# EAGLE design wemos-boost-rev-1b (EAGLE 7.3.0)
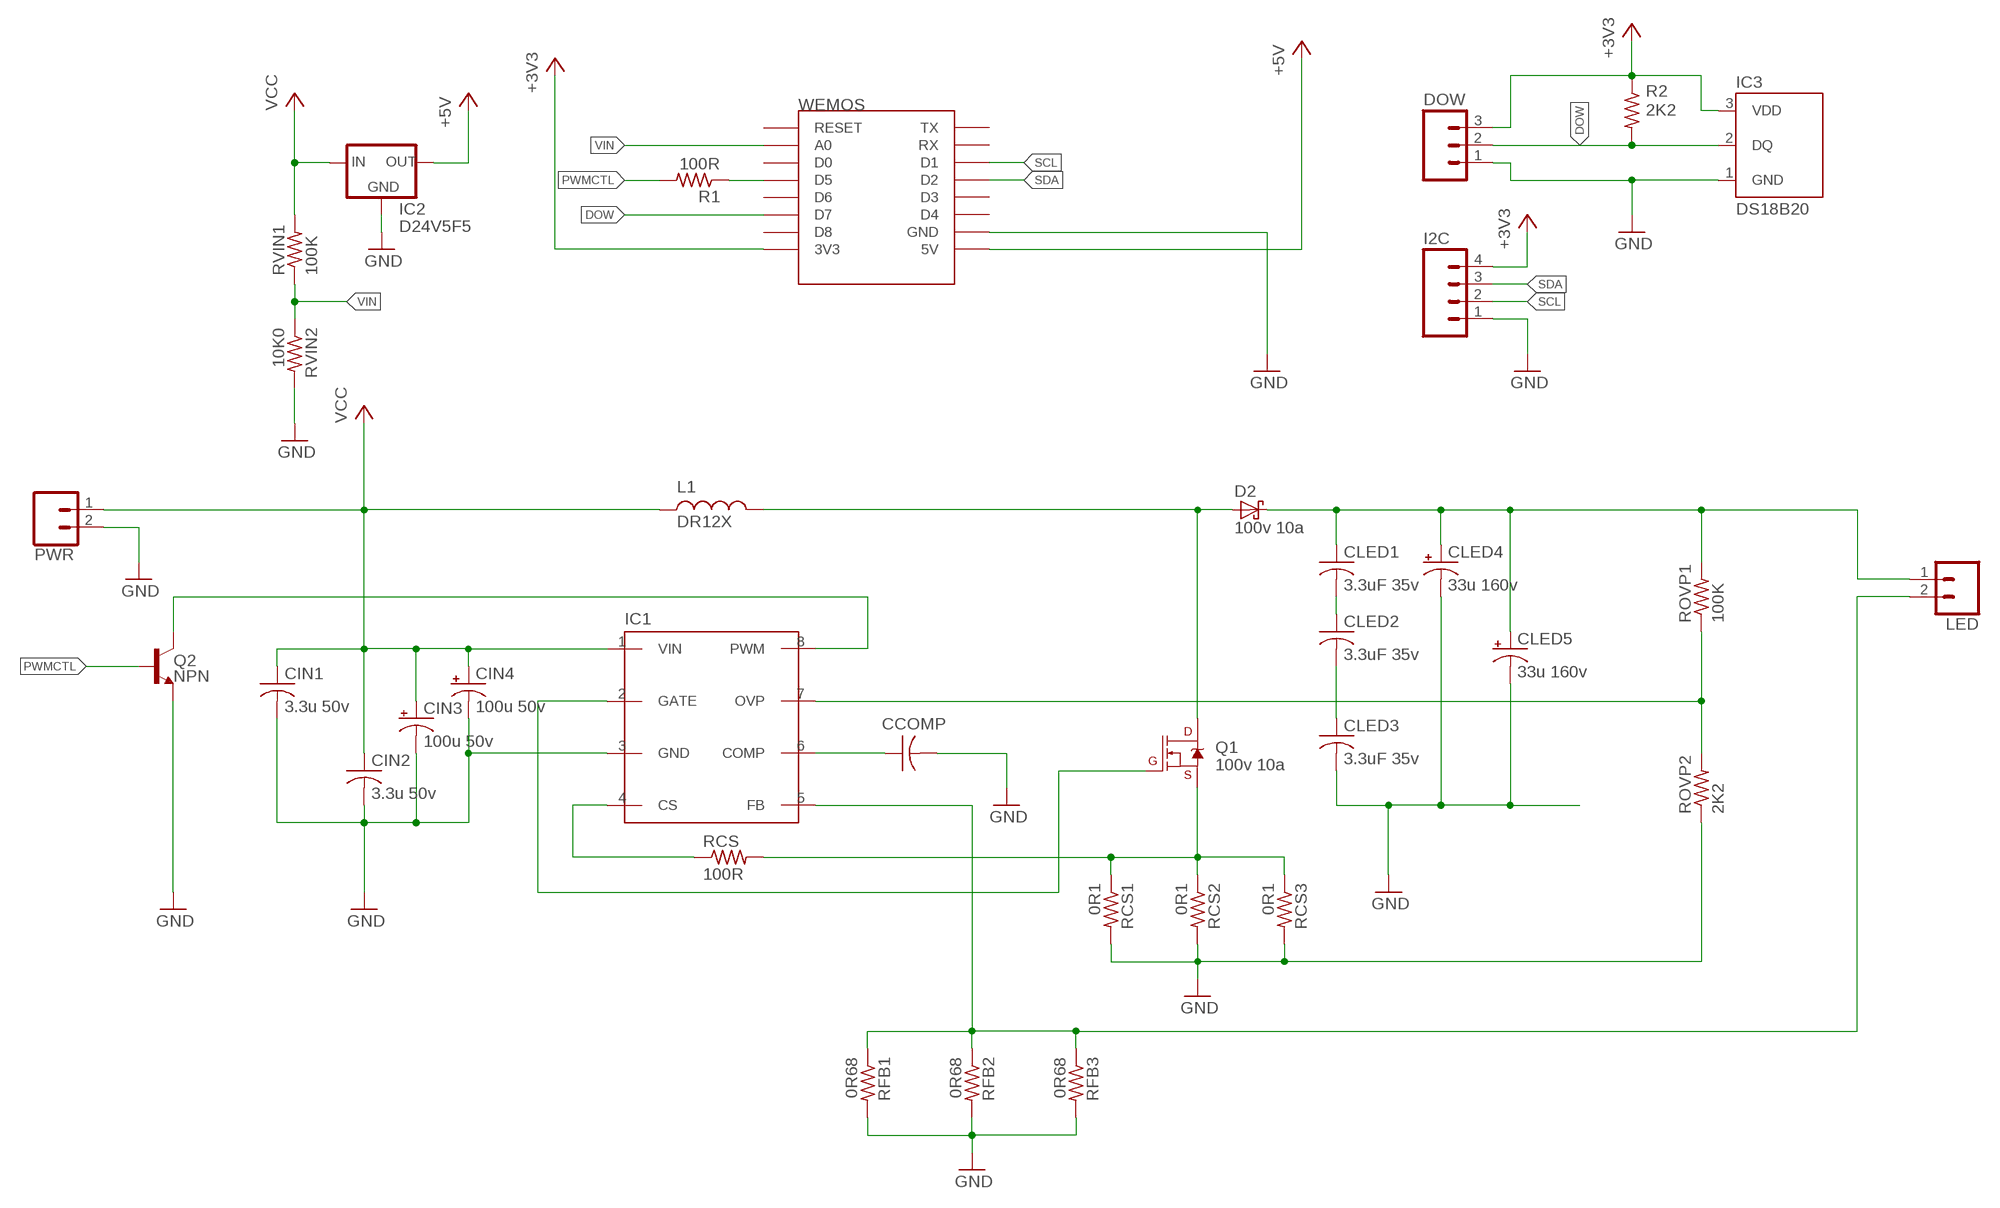
[diagram p0: schematic, sheet 1]

## Parts
CCOMP  C-USC0603  [C0603]
CIN1  3.3u 50v  C-USC1210  [C1210]
CIN2  3.3u 50v  C-USC1210  [C1210]
CIN3  100u 50v  CPOL-USF  [PANASONIC_F]
CIN4  100u 50v  CPOL-USF  [PANASONIC_F]
CLED1  3.3uF 35v  C-USC0805  [C0805]
CLED2  3.3uF 35v  C-USC0805  [C0805]
CLED3  3.3uF 35v  C-USC0805  [C0805]
CLED4  33u 160v  CPOL-USG  [PANASONIC_G]
CLED5  33u 160v  CPOL-USG  [PANASONIC_G]
D2  100v 10a  SCHOTTKY-SMB  [SMB]
DOW  M03SCREW_LOCK  [SCREWTERMINAL-3.5MM-3_LOCK.007S]
I2C  M04SCREW_LOCK  [SCREWTERMINAL-3.5MM-4_LOCK]
IC1  AL8853S-13  [SOP08]
IC2  D24V5F5  78XXS  [78XXS]
IC3  DS18B20  [TO-92-AMMO]
L1  DR12X  [DR12X]
LED  CONN_025MM  [SCREWTERMINAL-5MM-2]
PWR  CONN_025MM  [SCREWTERMINAL-5MM-2]
Q1  100v 10a  MOSFET-NCH-FDD8780  [TO-252/DPAK]
Q2  NPN  TRANS_NPN-MMBT2222AL  [SOT23-3]
R1  100R  R-US_R0603  [R0603]
R2  2K2  R-US_R0603  [R0603]
RCS  100R  R-US_R0603  [R0603]
RCS1  0R1  R-US_R2010  [R2010]
RCS2  0R1  R-US_R2010  [R2010]
RCS3  0R1  R-US_R2010  [R2010]
RFB1  0R68  R-US_R1206  [R1206]
RFB2  0R68  R-US_R1206  [R1206]
RFB3  0R68  R-US_R1206  [R1206]
ROVP1  100K  R-US_R0603  [R0603]
ROVP2  2K2  R-US_R0603  [R0603]
RVIN1  100K  R-US_R0603  [R0603]
RVIN2  10K0  R-US_R0603  [R0603]
WEMOS  WEMOS-D1-MINI  [WEMOS-D1-MINI]

## Nets
+3V3: DOW.3 I2C.4 IC3.3(VDD) R2.1 WEMOS.3V3
+5V: IC2.OUT WEMOS.5V
COMP: CCOMP.1 IC1.6(COMP)
CS: IC1.4(CS) RCS.1
CS`: Q1.3(S) RCS1.1 RCS2.1 RCS3.1 RCS.2
DOW: DOW.2 IC3.2(DQ) R2.2 WEMOS.D7
FB: IC1.5(FB) LED.2 RFB1.1 RFB2.1 RFB3.1
GATE: IC1.2(GATE) Q1.1(G)
GND: CCOMP.2 CIN1.2 CIN2.2 CIN3.- CIN4.- CLED3.2 CLED4.- CLED5.- DOW.1 I2C.1 IC1.3(GND) IC2.GND IC3.1(GND) PWR.2 Q2.2(E) RCS1.2 RCS2.2 RCS3.2 RFB1.2 RFB2.2 RFB3.2 ROVP2.1 RVIN2.2 WEMOS.GND
LEDPWR: CLED1.1 CLED4.+ CLED5.+ D2.K LED.1 ROVP1.2
N$1: R1.1 WEMOS.D5
N$2: CLED1.2 CLED2.1
N$3: CLED2.2 CLED3.1
OVP: IC1.7(OVP) ROVP1.1 ROVP2.2
PWM: IC1.8(PWM) Q2.3(C)
PWMCTL: Q2.1(B) R1.2
SCL: I2C.2 WEMOS.D1
SDA: I2C.3 WEMOS.D2
SWITCHNODE: D2.A L1.P$1 Q1.2(D)
VCC: CIN1.1 CIN2.1 CIN3.+ CIN4.+ IC1.1(VIN) IC2.IN L1.P$2 PWR.1 RVIN1.2
VIN: RVIN1.1 RVIN2.1 WEMOS.A0
Unconnected: WEMOS.D0 WEMOS.D3 WEMOS.D4 WEMOS.D6 WEMOS.D8 WEMOS.RESET WEMOS.RX WEMOS.TX

## Library data of the parts
CCOMP CIN1 CIN2 CLED1-CLED3 = rcl:C-US: CAPACITOR, American symbol
CIN3 CIN4 CLED4 CLED5 = rcl:CPOL-US: POLARIZED CAPACITOR, American symbol
D2 = diode-special-packages:SCHOTTKY
DOW = SparkFun-Connectors:M03: Header 3 Standard 3-pin 0.1" header. Use with straight break away headers (SKU : PRT-00116), right angle break away headers (PRT-00553), swiss pins (PRT-00743), machine pins (PRT-00117), and female headers (PRT-00115). Molex polarized connector foot print use with SKU : PRT-08232 with associated crimp pins and housings.; PROD_ID: CONN-08288
I2C = SparkFun-Connectors:M04: Header 4 Standard 4-pin 0.1" header. Use with straight break away headers (SKU : PRT-00116), right angle break away headers (PRT-00553), swiss pins (PRT-00743), machine pins (PRT-00117), and female headers (PRT-00115). Molex polarized connector foot print use with SKU : PRT-08231 with associated crimp pins and housings. 1MM SMD Version SKU: PRT-10208
IC1 = vreg-special:AL8853S-13: The AL8853 is a highly integrated and cost effective Light Emitting Diode (LED) controller. It provides a high performance LED backlight solution with low BOM cost.
IC2 = v-reg:78XXS: VOLTAGE REGULATOR
IC3 = SparkFun-Sensors:DS18B20: Dallas/Maxim DS18B20 1-wire temperature sensor Datasheet: http://datasheets.maximintegrated.com/en/ds/DS18B20.pdf temp thermometer 1-wire one-wire one wire; STORE_ID: SEN-00245
L1 = inductor-power:DR
LED PWR = SparkFun-Connectors:CONN_02: Multi connection point. Often used as Generic Header-pin footprint for 0.1 inch spaced/style header connections On any of the 0.1 inch spaced packages, you can populate with these: Break Away Headers - Straight <https://www.sparkfun.com/products/116> (PRT-00116) Break Away Male Headers - Right Angle <https://www.sparkfun.com/products/553> (PRT-00553) Female Headers <https://www.sparkfun.com/products/115> (PRT-00115) Break Away Headers - Machine Pin <https://www.sparkfun.com/products/117> (PRT-00117) Break Away Female Headers - Swiss Machine Pin <https://www.sparkfun.com/products/743> (PRT-00743) For SCREWTERMINALS and SPRING TERMINALS visit here: Screw Terimnals on SparkFun.com <https://www.sparkfun.com/search/results?term=Screw+Terminals> (5mm/3.5mm/2.54mm spacing) This device is also useful as a general connection point to wire up your design to another part of your project. Our various solder wires solder well into these plated through hole pads. Hook-Up Wire - Assortment (Stranded, 22 AWG) <https://www.sparkfun.com/products/11375> (PRT-11375) Hook-Up Wire - Assortment (Solid Core, 22 AWG) <https://www.sparkfun.com/products/11367> (PRT-11367) View the entire wire category on our website here <https://www.sparkfun.com/categories/141> Special notes: Molex polarized connector foot print use with: PRT-08233 with associated crimp pins and housings. 2.54_SCREWTERM for use with PRT-10571. 3.5mm Screw Terminal footprints for PRT-08084 5mm Screw Terminal footprints for use with PRT-08432; SF_SKU: PRT-08432
Q1 = SparkFun-DiscreteSemi:MOSFET-NCH: N-channel MOSFETs Voltage controlled devices that allow control of high current outputs. SparkFun Products: SparkFun OpenScale <https://www.sparkfun.com/products/13261> SparkFun Digital Sandbox <https://www.sparkfun.com/products/12651> SparkFun Monster Moto Shield <https://www.sparkfun.com/products/10182> SparkFun MOSFET Power Controller <https://www.sparkfun.com/products/11214>; PROD_ID: TRANS-09984; VALUE: 35A/25V/8.5mΩ
Q2 = SparkFun-DiscreteSemi:TRANS_NPN: NPN transistor Current controlled devices typically used to amplify current or used as a switch. BC547 - COM-08928 <http://www.sparkfun.com/products/8928> (TO-92 45V 100mA) (1.Collector 2.Base 3.Emitter) 2N3904 - COM-00521 <http://www.sparkfun.com/products/521> (TO-92 40V 200mA) (1.Emitter 2.Base 3.Collector) P2N2222A - COM-12852 <http://www.sparkfun.com/products/12852> (TO-92 40V 600mA) (1.Collector 2.Base 3.Emitter); PROD_ID: TRANS-08049; VALUE: 600mA/40V
R1 R2 RCS RCS1-RCS3 RFB1-RFB3 ROVP1 ROVP2 RVIN1 RVIN2 = rcl:R-US_: RESISTOR, American symbol
WEMOS = esp8266modules:WEMOS-D1-MINI: WeMos.cc D1 mini ESP8266 module

## Board
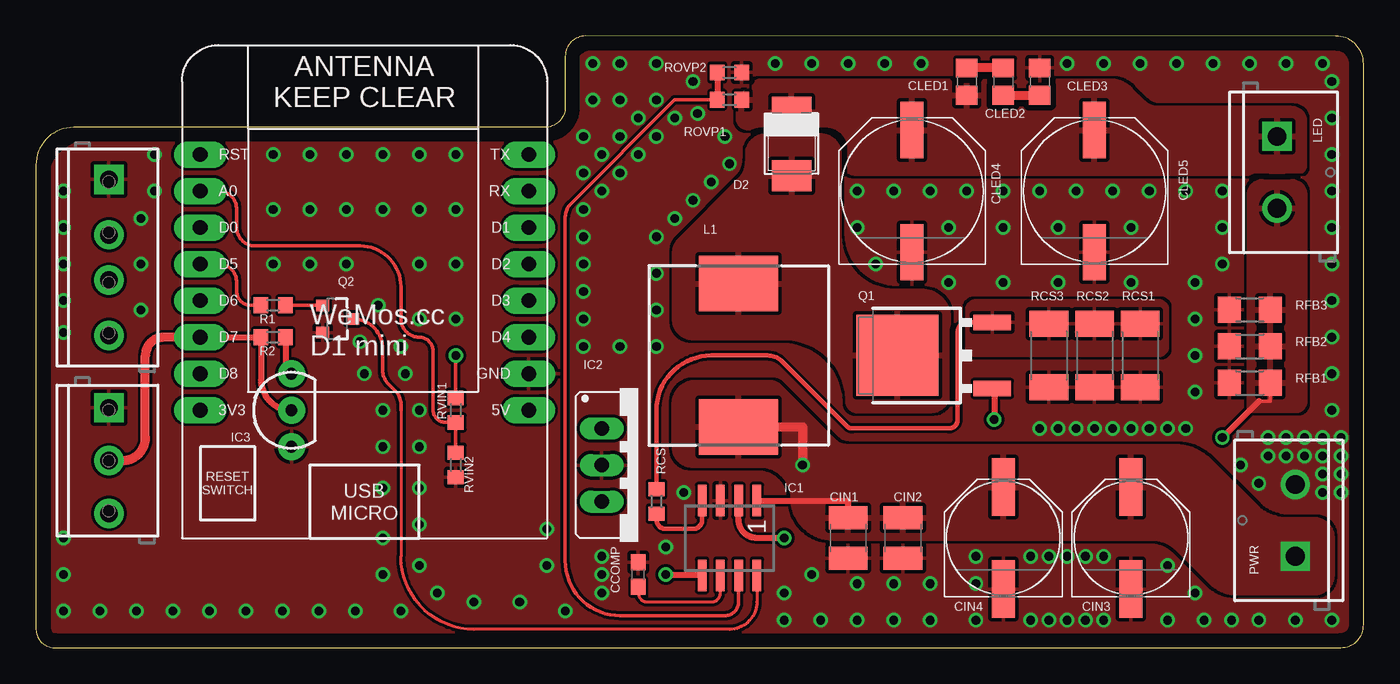
[diagram p1: board, top side]
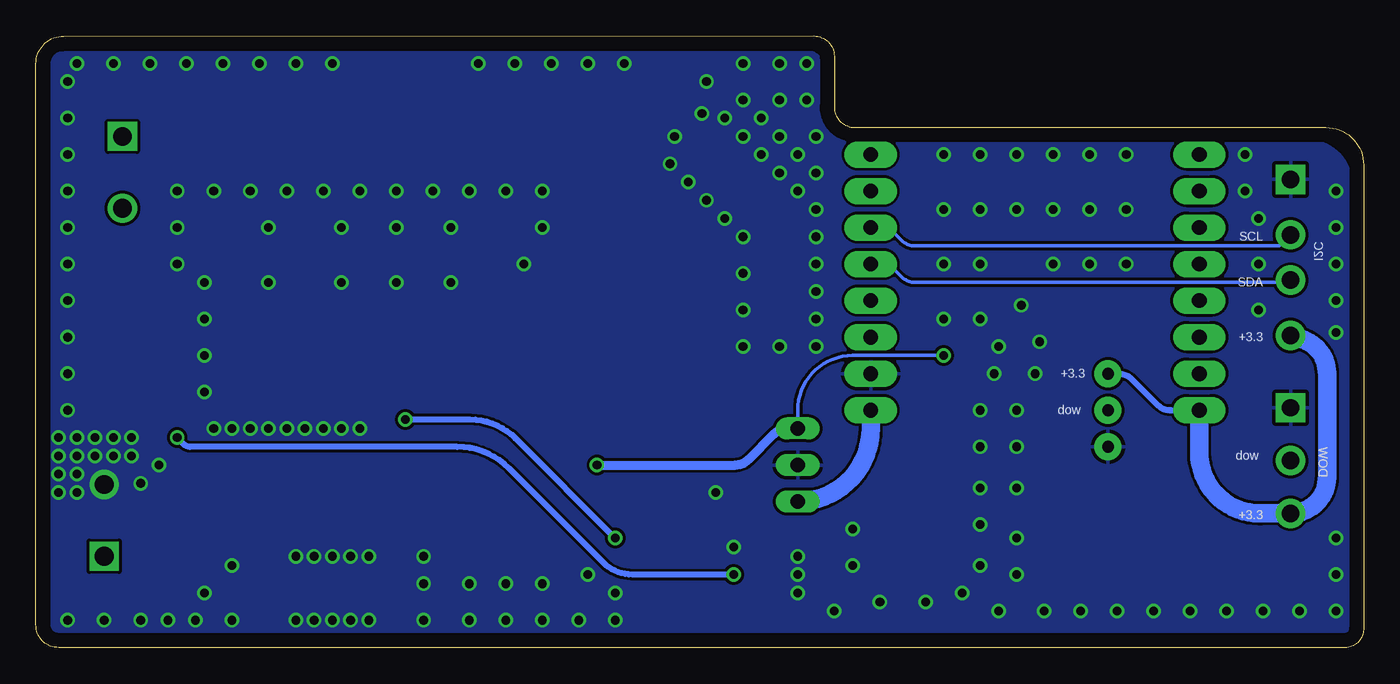
[diagram p2: board, bottom side, seen from below]

Size 92.38 x 42.54 mm. Coordinates in mm from the lower left corner, seen from the top.
Outline: 1.27,0 90.8,0 arc90 92.38,1.58 92.38,40.61 arc90 90.46,42.53 38.25,42.55 arc90 36.83,41.12 36.83,37.6 arc-90 35.41,36.19 2.62,36.19 arc90 0,33.56 0,1.27 arc90 1.27,0
Copper layers (1*16): Top 0.035mm / dielectric 1.5mm / Bottom 0.035mm
Design rules "default": minimum track width 10mil, minimum drill 24mil, track to track 8mil, track to pad 8mil, pad to pad 8mil, via to via 8mil, smd to smd 8mil, copper to edge 40mil, drill to drill 8mil, minimum pad ring 10mil, minimum via ring 8mil, stop-mask expansion 4mil, vias tented up to drill 0mil, thermal gap 10mil

### Footprints (pad centres in the part's own frame; a part is rotated, then mirrored left to right if it is on the bottom)
C0603 = smd 1.1 x 1: 1 -0.85,0; 2 0.85,0
C1210 = smd 1.6 x 2.7: 1 -1.4,0; 2 1.4,0
PANASONIC_F = smd 4 x 1.6: + 3.55,0; - -3.55,0
C0805 = smd 1.3 x 1.5: 1 -0.95,0; 2 0.95,0
PANASONIC_G = smd 3.9 x 1.6: + 4.25,0; - -4.25,0
SMB = smd 2.159 x 2.743: A 2.108,-0.102; K -2.311,-0.127
SCREWTERMINAL-3.5MM-3_LOCK.007S = drill 1.2 pad 2.032 square: 1 -0.178,0 | drill 1.2 pad 2.032: 2 3.5,0; 3 7.178,0
SCREWTERMINAL-3.5MM-4_LOCK = drill 1.2 pad 2.032 square: 1 -0.178,0 | drill 1.2 pad 2.032: 2 3.678,0; 3 6.822,0; 4 10.678,0
SOP08 = smd 0.6 x 2.2: 1 -1.905,-2.6; 2 -0.635,-2.6; 3 0.635,-2.6; 4 1.905,-2.6; 5 1.905,2.6; 6 0.635,2.6; 7 -0.635,2.6; 8 -1.905,2.6
78XXS = drill 1.016 long: GND 0,-2.54; IN -2.54,-2.54; OUT 2.54,-2.54
TO-92-AMMO = drill 0.813 pad 1.88: 1 -2.54,0; 2 0,0; 3 2.54,0
DR12X = smd 3.85 x 5.5: P$1 -5,0; P$2 4.975,0
SCREWTERMINAL-5MM-2 = drill 1.3 pad 2.032 square: 1 0,0 | drill 1.3 pad 2.032: 2 5,0
TO-252/DPAK = smd 1.06 x 2.6: 1 -2.3,-4.31; 3 2.3,-4.31 | smd 5.632 x 5.7: 2 0,2.288
SOT23-3 = smd 0.8 x 0.9: 1 -0.95,-1; 2 0.95,-1; 3 0,1.1
R0603 = smd 1 x 1.1: 1 -0.85,0; 2 0.85,0
R2010 = smd 1.8 x 2.7: 1 -2.2,0; 2 2.2,0
R1206 = smd 1.6 x 1.803: 1 -1.422,0; 2 1.422,0
WEMOS-D1-MINI = drill 1.016 pad 1.829 long: 3V3 -10.16,-10.16; 5V 12.7,-10.16; A0 -10.16,5.08; D0 -10.16,2.54; D1 12.7,2.54; D2 12.7,0; D3 12.7,-2.54; D4 12.7,-5.08; D5 -10.16,0; D6 -10.16,-2.54; D7 -10.16,-5.08; D8 -10.16,-7.62; GND 12.7,-7.62; RESET -10.16,7.62; RX 12.7,5.08; TX 12.7,7.62

### Placement (x,y rotation side)
CCOMP  41.91,5.08 90 top
CIN1  56.52,7.62 270 top
CIN2  60.33,7.62 270 top
CIN3  76.2,7.62 90 top
CIN4  67.31,7.62 90 top
CLED1  64.77,39.37 90 top
CLED2  67.31,39.37 270 top
CLED3  69.85,39.37 90 top
CLED4  60.96,31.75 90 top
CLED5  73.66,31.75 90 top
D2  52.7,34.92 270 top
DOW  5.08,16.51 270 top
I2C  5.08,32.38 270 top
IC1  48.26,7.62 180 top
IC2  41.91,12.7 270 top
IC3  17.78,16.51 90 top
L1  48.9,20.32 270 top
LED  86.36,35.56 270 top
PWR  87.63,6.35 90 top
Q1  62.23,20.32 90 top
Q2  20.95,22.86 270 top
R1  16.51,23.81 0 top
R2  16.51,21.59 180 top
RCS  43.18,10.16 90 top
RCS1  76.83,20.32 270 top
RCS2  73.66,20.32 270 top
RCS3  70.48,20.32 270 top
RFB1  84.45,18.41 180 top
RFB2  84.45,20.95 180 top
RFB3  84.45,23.5 180 top
ROVP1  48.26,38.1 0 top
ROVP2  48.26,40.01 180 top
RVIN1  29.21,16.51 90 top
RVIN2  29.21,12.7 270 top
WEMOS  21.59,26.67 0 top

### Tracks (layer width: path | path; a pad name or v marks a point on that pad's centre or on a via)
+3V3
  Top 0.406: R2.1 17.36,19.05 IC3.3
  Bottom 0.406: IC3.3 17.04,19.05 arc45 16.14,18.68 14.34,16.88 arc-45 13.44,16.51 WEMOS.3V3
  Bottom 1.27: I2C.4 5.08,21.59 arc90 2.54,19.05 2.54,11.87 arc90 DOW.3 7.21,9.33 arc90 11.43,13.55 WEMOS.3V3
+5V
  Bottom 1.27: IC2.OUT arc-90 34.29,15.24 WEMOS.5V
COMP
  Top 0.203: CCOMP.1 41.91,3.81 arc90 42.55,3.17 46.99,3.17 arc90 47.62,3.81 IC1.6
CS
  Top 0.203: RCS.1 43.18,8.89
  Top 0.305: 43.18,8.89 arc90 43.81,8.26 45.72,8.26 arc90 46.35,8.89 IC1.4
CS`
  Top 0.305: RCS.2 43.18,16.51 arc-90 46.99,20.32 50.91,20.32 arc-45 51.93,19.89 56.42,15.4 arc45 56.82,15.24 63.5,15.24 arc90 64.14,15.88 64.14,21.94 arc-90 64.81,22.62 Q1.3
  pour Top (isolate 0.406, rank 4): 78.74,23.5 78.74,20.95 arc-90 78.11,20.32 65.41,20.32 arc-90 64.77,20.95 64.77,23.5 arc-90 65.41,24.13 78.11,24.13 arc-90
DOW
  Top 0.406: WEMOS.D7 R2.2 15.66,18.63 arc90 IC3.2
  Top 0.61: WEMOS.D7 8.89,21.59 arc90 7.62,20.32 7.62,14.6 arc-90 6.03,13.01 DOW.2
FB  (via drill 0.6)
  Top 0.254: 43.81,5.02 v43.81,5.08 | 85.09,17.14 85.88,17.14 RFB1.1
  Top 0.406: IC1.5 43.81,5.02 | v82.55,14.61 85.09,17.14
  Bottom 0.406: v43.81,5.08 50.89,5.08 arc45 52.9,5.91 59.47,12.48 arc-45 63.06,13.97 81.65,13.97 arc45 82.1,14.16 v82.55,14.61
  pour Top (isolate 0.406, rank 3): 84.45,16.51 84.45,31.49 arc-90 85.35,32.38 87.37,32.38 arc-90 88.27,31.49 88.27,17.15 arc-90 87.63,16.51
GATE  (via drill 0.6)
  Top 0.254: Q1.1 66.67,18.02
  Top 0.406: 66.67,18.02 v66.67,15.88 | v52.07,7.62 50.16,7.62 arc-90 48.9,8.89 IC1.2
  Bottom 0.406: v66.67,15.88 62.19,15.88 arc45 59.01,14.56 v52.07,7.62
GND  (via drill 0.6)
  other vias: 77.47,15.24 76.2,15.24 74.93,15.24 73.66,15.24 72.39,15.24 71.12,15.24 69.85,15.24 85.72,13.34 90.81,12.06 90.81,10.79 89.53,10.79 89.53,12.06 90.81,13.34 87,13.34 88.27,13.34 89.53,13.34 90.81,13.34 78.74,1.91 74.3,1.91 73.03,1.91 71.75,1.91 70.48,1.91 69.22,1.91 69.22,6.35 70.48,6.35 71.75,6.35 73.03,6.35 74.3,6.35 52.07,1.91 52.07,3.81 45.09,10.79 43.81,6.99 39.37,6.35 39.37,5.08 39.37,3.81 16.51,30.48 26.67,30.48 29.21,30.48 7.3,23.5 26.67,13.97 26.67,11.11 26.67,8.57 24.13,13.97 24.13,11.11 24.13,7.62 30.48,3.17 27.94,3.81 26.67,5.71 24.13,5.08 25.4,2.54 26.67,34.29 21.59,34.29 19.05,34.29 16.51,34.29 19.05,30.48 21.59,30.48 24.13,34.29 24.13,30.48 26.67,22.86 29.21,34.29 41.91,36.83 33.66,3.17 36.83,2.54 40.64,35.56 39.37,34.29 38.1,33.02 44.45,36.83 43.18,35.56 41.91,34.29 40.64,33.02 39.37,31.75 43.18,38.1 45.72,39.37 71.75,40.64 74.3,40.64 76.83,40.64 79.38,40.64 81.92,40.64 90.17,39.37 90.17,36.83 90.17,34.29 90.17,31.75 90.17,29.21 90.17,26.67 90.17,24.13 90.17,21.59 90.17,19.05 90.17,16.51 1.91,31.75 1.91,29.21 1.91,26.67 1.91,24.13 1.91,2.54 1.91,5.08 1.91,7.62 4.45,2.54 6.99,2.54 9.53,2.54 12.06,2.54 14.61,2.54 17.14,2.54 19.68,2.54 22.23,2.54 40.64,40.64 56.52,40.64 53.98,40.64 51.44,40.64 59.05,40.64 61.59,40.64 84.45,40.64 87,40.64 89.53,40.64 54.61,1.91 57.15,1.91 59.69,1.91 62.23,1.91 62.23,4.45 65.41,1.91 81.28,1.91 90.17,1.91 87.63,1.91 85.09,1.91 83.19,1.91 57.15,31.75 59.69,31.75 62.23,31.75 64.77,31.75 67.31,31.75 69.85,31.75 72.39,31.75 74.93,31.75 77.47,31.75 80.01,31.75 82.55,31.75 82.55,29.21 82.55,26.67 76.2,25.4 76.2,29.21 71.12,25.4 71.12,29.21 63.5,25.4 63.5,29.21 57.15,29.21 58.42,26.67 67.31,29.21 67.31,25.4 78.74,15.24 80.01,15.24 80.64,17.78 80.64,20.32 80.64,22.86 80.64,25.4 48.26,33.66 46.99,32.38 45.72,31.11 44.45,29.84 43.18,28.57 43.18,26.04 43.18,23.5 43.18,20.95 57.15,4.45 59.69,4.45 65.41,6.35 80.64,3.81 78.74,5.71 83.82,12.7 85.09,11.43 85.72,14.61 87,14.61 88.27,14.61 89.53,14.61 90.81,14.61 53.98,5.08 65.41,4.45 38.1,30.48 38.1,28.57 38.1,26.67 38.1,24.77 38.1,22.86 38.1,20.95 35.56,5.71 35.56,8.26 40.64,20.95 7.3,29.84 38.73,38.1 38.1,35.56 40.64,38.1 24.13,16.51 26.67,16.51 25.72,19.05 16.51,26.67 19.05,26.67 21.59,26.67 26.67,26.67 29.21,26.67 29.21,22.86 22.86,19.05 22.54,21.27 25.4,20.95 23.81,23.81 7.3,26.67 47.94,35.56 46.04,37.15 1.91,21.91 8.26,34.29 8.26,31.75 43.18,40.64 38.73,40.64
  pour Top (isolate 0.203, rank 6): 0.95,0.64 0.95,32.37 arc-90 3.83,35.24 34.12,35.24 arc90 36.83,37.96 36.83,39.03 arc-90 39.39,41.59 91.44,41.59 91.44,0.64
  pour Bottom (isolate 0.203, rank 5): 91.44,41.59 39.39,41.59 arc90 36.83,39.03 36.83,37.8 arc-90 34.27,35.24 3.83,35.24 arc90 0.95,32.37 0.95,0.64 91.44,0.64
  pour Top (isolate 0.254, rank 2, no thermals): 89.53,9.53 87.73,9.53 arc-90 85.72,11.53 85.72,13.34 89.53,13.34
  pour Bottom (isolate 0.254, rank 2, no thermals): 85.72,13.34 89.53,13.34 89.53,9.53 85.72,9.53
LEDPWR
  pour Top (isolate 0.406, rank 4): 55.88,34.29 arc90 57.15,33.02 87.63,33.02 arc90 88.27,33.66 88.27,36.57 arc90 87.37,37.47 78.06,37.47 arc-45 77.05,37.88 76.12,38.81 arc45 74.78,39.37 50.43,39.37 arc45 49.98,39.18 48.9,38.1 48.9,36.83 arc90 49.53,36.2 53.98,36.2 arc-90
N$1
  Top 0.254: WEMOS.D5 12.7,26.67 arc-90 13.97,25.4 13.97,24.77 arc90 14.92,23.81 R1.1
N$2
  Top 0.61: CLED2.1 CLED1.2
N$3
  Top 0.61: CLED2.2 CLED3.1
OVP
  Top 0.254: IC1.7 48.9,3.17 arc-90 47.94,2.22 40.64,2.22 arc-90 36.83,6.03 36.83,29.95 arc-45 37.2,30.85 44.45,38.1 ROVP1.1
  Top 0.406: ROVP2.2 ROVP1.1
PWM
  Top 0.203: IC1.8 50.16,3.17 arc-90 48.26,1.27 30.48,1.27 arc-90 25.4,6.35 25.4,16.51
  Top 0.254: Q2.3 arc-90 24.13,20.79 24.13,19.27 arc45 24.51,18.35 25.02,17.85 arc-45 25.4,16.92 25.4,16.51
PWMCTL
  Top 0.254: R1.2 Q2.1
SCL
  Bottom 0.254: I2C.2 5.85,27.94 31.22,27.94 arc45 32.12,28.31 33.02,29.21 WEMOS.D1
SDA
  Bottom 0.254: I2C.3 5.24,25.4 31.22,25.4 arc45 32.12,25.77 33.02,26.67 WEMOS.D2
SWITCHNODE
  pour Top (isolate 0.406, rank 3): 61.59,24.77 59.74,24.77 arc-90 55.88,28.63 55.88,34.29 arc90 54.61,35.56 50.8,35.56 arc90 49.53,34.29 49.53,33.76 arc-45 49,32.49 44.82,28.31 arc45 44.45,27.41 44.45,22.86 arc90 45.72,21.59 52.07,21.59 arc-90 56.52,17.14 arc90 57.15,16.51 62.23,16.51 arc90 63.5,17.78 63.5,22.86 arc90
VCC  (via drill 0.6)
  Top 0.254: v29.21,20.32 RVIN1.2
  Top 0.406: IC1.1 56.52,10.22 CIN1.1
  Top 0.61: L1.P$2 53.34,15.35 v53.34,12.7
  Bottom 0.254: IC2.IN 39.37,16.51 arc90 35.56,20.32 v29.21,20.32
  Bottom 0.61: v53.34,12.7 43.71,12.7 arc-45 42.81,13.07 41.01,14.87 arc45 40.11,15.24 IC2.IN
  pour Top (isolate 0.254, rank 2): 45.87,18.41 51.06,18.41 arc-45 51.7,18.15 55.51,14.34 arc45 56.41,13.97 79.23,13.97 arc-45 81.65,12.97 84.8,9.82 arc45 87.04,8.89 88.9,8.89 arc-90 90.17,7.62 90.17,5.08 arc-90 88.9,3.81 83.6,3.81 arc-45 81.81,4.55 79.48,6.88 arc45 77.69,7.62 55.5,7.62 arc-90 52.7,10.41 arc90 50.42,12.7 45.72,12.7 arc-90 44.45,13.97 44.45,17 arc-90
  pour Top (isolate 0.254, rank 2, no thermals): 85.72,8.26 89.53,8.26 89.53,4.45 85.72,4.45
VIN
  Top 0.254: RVIN2.1 RVIN1.1 28.53,15.66 arc-90 27.62,16.57 27.62,20.64 arc90 26.67,21.59 arc-90 25.4,22.86 25.4,25.1 arc90 22.56,27.94 15.24,27.94 arc-90 13.97,29.21 13.97,30.48 arc90 12.7,31.75 WEMOS.A0

### Text on the board
bNames: SCL | SDA | +3.3 | +3.3 | dow | dow | +3.3